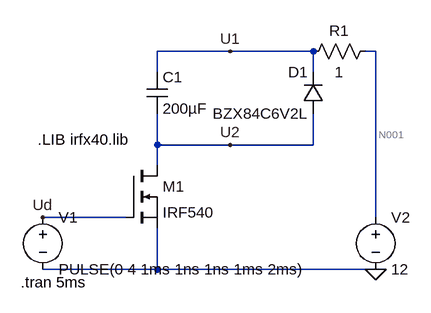
[diagram p0: schematic Draft5.asc]
Draft5.asc, the LTspice schematic file:
Version 4
SHEET 1 880 680
WIRE 320 -128 208 -128
WIRE 448 -128 320 -128
WIRE 544 -128 528 -128
WIRE 208 -96 208 -128
WIRE 448 -96 448 -128
WIRE 208 16 208 -32
WIRE 320 16 208 16
WIRE 448 16 448 -32
WIRE 448 16 320 16
WIRE 208 48 208 16
WIRE 160 128 32 128
WIRE 544 128 544 -128
WIRE 208 208 208 144
WIRE 208 208 32 208
WIRE 544 208 208 208
FLAG 320 -128 U1
FLAG 320 16 U2
FLAG 544 208 0
FLAG 32 128 Ud
SYMBOL voltage 32 112 R0
WINDOW 123 0 0 Left 0
WINDOW 39 0 0 Left 0
SYMATTR InstName V1
SYMATTR Value PULSE(0 4 1ms 1ns 1ns 1ms 2ms)
SYMBOL nmos 160 48 R0
SYMATTR InstName M1
SYMATTR Value IRF540
SYMBOL cap 192 -96 R0
SYMATTR InstName C1
SYMATTR Value 200µF
SYMBOL diode 464 -32 R180
WINDOW 0 24 64 Left 2
WINDOW 3 24 0 Left 2
SYMATTR InstName D1
SYMATTR Value BZX84C6V2L
SYMBOL res 544 -144 R90
WINDOW 0 0 56 VBottom 2
WINDOW 3 32 56 VTop 2
SYMATTR InstName R1
SYMATTR Value 1
SYMBOL voltage 544 112 R0
WINDOW 123 0 0 Left 0
WINDOW 39 0 0 Left 0
SYMATTR InstName V2
SYMATTR Value 12
TEXT -2 228 Left 2 !.tran 5ms
TEXT 24 8 Left 2 !.LIB irfx40.lib

The netlist it stands for:
* Draft5.asc
V1 Ud 0 PULSE(0 4 1ms 1ns 1ns 1ms 2ms)
M1 U2 Ud 0 0 IRF540
C1 U1 U2 200µF
D1 U2 U1 BZX84C6V2L
R1 N001 U1 1
V2 N001 0 12
.model D D
.lib standard.dio
.model NMOS NMOS
.model PMOS PMOS
.lib standard.mos
.tran 5ms
.LIB irfx40.lib
.backanno
.end

* Results of the author's LTspice run, read from the files saved beside the schematic
* Operating Point, zero values left out:
*   V(u2) = 6.132 V
*   V(u1) = 12 V
*   V(n001) = 12 V
*   Id(M1) = 13.8 µA
*   Ib(M1) = -8.991 pA
*   Is(M1) = -13.8 µA
*   I(D1) = -13.8 µA
*   I(R1) = 13.8 µA
*   I(V2) = -13.8 µA
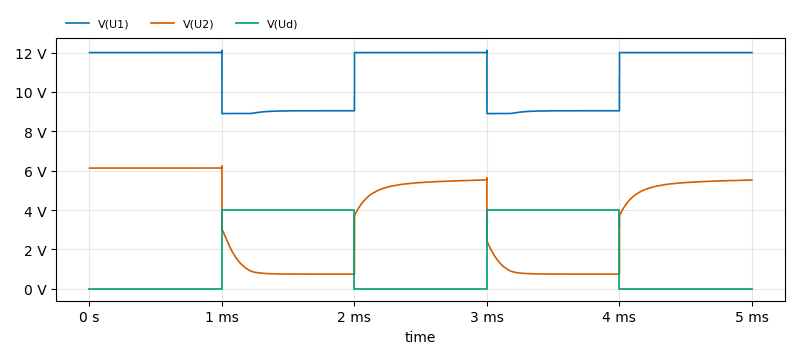
[diagram p1: Transient Analysis of Draft5.asc, plotted from the saved traces]
* Transient Analysis, 1 run:
*   V(U1): min 8.902 V, max 12.11 V, average 10.8 V, rms 10.9 V, last 12 V
*   V(U2): min 745.4 mV, max 6.244 V, average 3.69 V, rms 4.353 V, last 5.525 V
*   V(Ud): min 0 V, max 4 V, average 1.6 V, rms 2.53 V, last 0 V